# EAGLE schematic EncoderTBPCB (EAGLE 7.7.0)
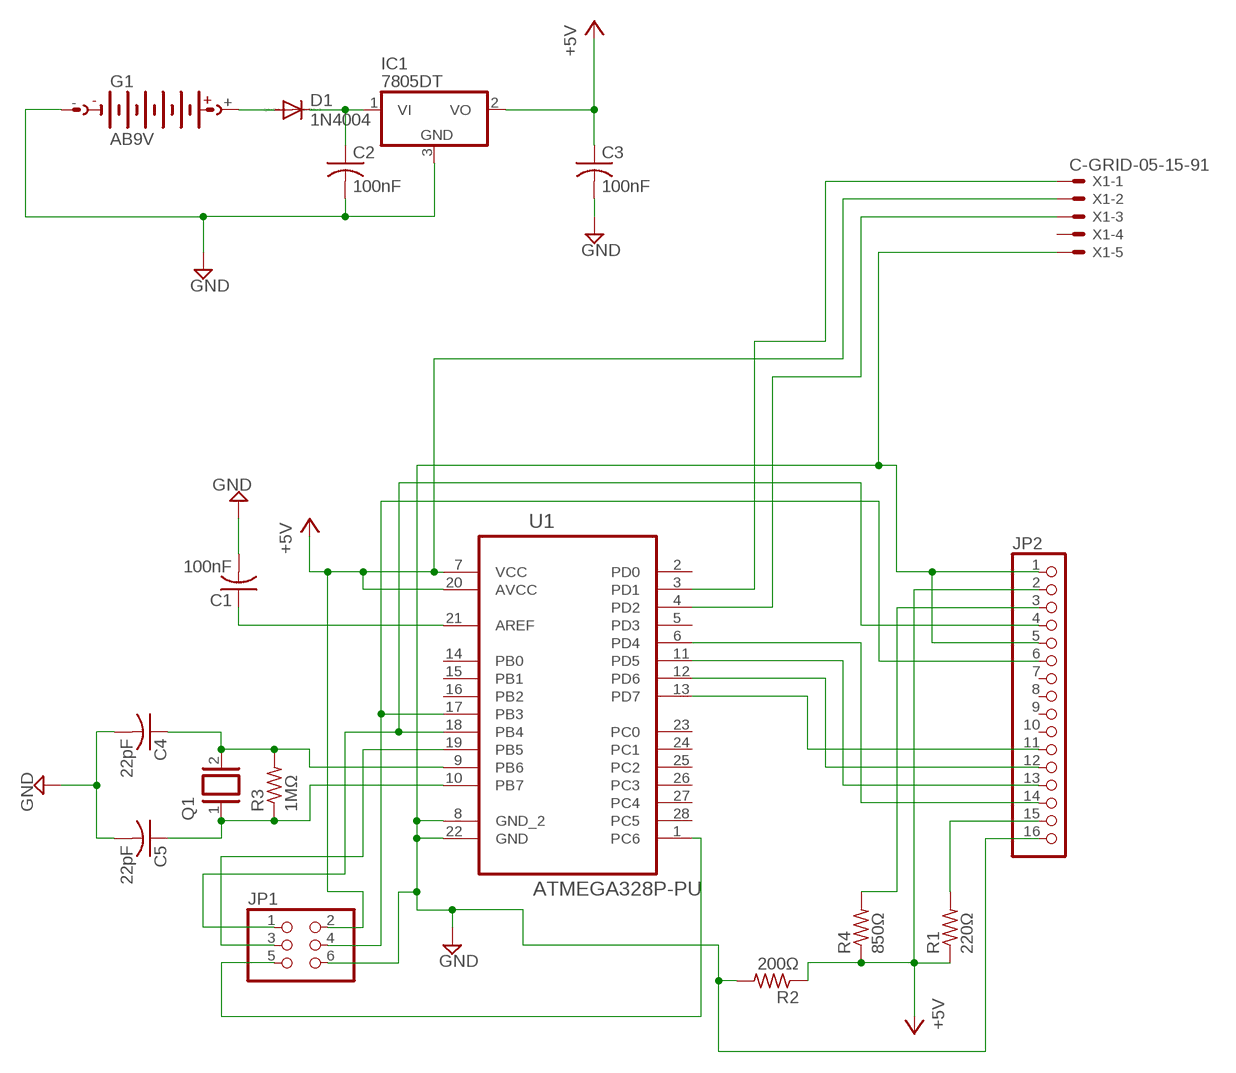
[diagram p0: schematic, sheet 1]

## Parts
C1  100nF  C-USC0603  [C0603]
C2  100nF  C-USC0603  [C0603]
C3  100nF  C-USC0603  [C0603]
C4  22pF  C-USC0603  [C0603]
C5  22pF  C-USC0603  [C0603]
D1  1N4004  [DO41-10]
G1  AB9V  [AB9V]
IC1  7805DT  [TO252]
JP1  PINHD-2X3  [2X03]
JP2  PINHD-1X16  [1X16]
Q1  XTAL/S  [QS]
R1  220Ω  R-US_R0603  [R0603]
R2  200Ω  R-US_R0603  [R0603]
R3  1MΩ  R-US_R0603  [R0603]
R4  850Ω  R-US_R0603  [R0603]
U1  ATMEGA328P-PU  [DIP254P762X457-28]
X1  C-GRID-05-15-91  [15-91-05]

## Nets
N$1: JP1.4 JP2.6 U1.17(PB3)
N$2: JP2.15 R1.2
N$4: JP2.14 U1.6(PD4)
N$5: JP2.13 U1.11(PD5)
N$6: JP2.12 U1.12(PD6)
N$7: JP2.11 U1.13(PD7)
N$9: JP1.1 JP2.4 U1.18(PB4)
N$10: C4.1 Q1.2 R3.2 U1.9(PB6)
N$11: C5.1 Q1.1 R3.1 U1.10(PB7)
N$12: C1.1 U1.21(AREF)
N$13: U1.3(PD1) X1.1
N$14: U1.4(PD2) X1.3
N$15: D1.A G1.+
N$16: C2.1 D1.C IC1.1(VI)
N$18: JP1.3 U1.19(PB5)
N$19: JP1.5 U1.1(PC6)
VDD: C3.1 IC1.2(VO) JP1.2 JP2.2 R1.1 R2.1 R4.1 U1.7(VCC) U1.20(AVCC) X1.2 ; supply symbol labelled +5V
VO: JP2.3 R4.2
VSS: C1.2 C2.2 C3.2 C4.2 C5.2 G1.- IC1.3(GND) JP1.6 JP2.1 JP2.5 JP2.16 R2.2 U1.8(GND_2) U1.22(GND) X1.5 ; supply symbol labelled GND
Unconnected: JP2.7 JP2.8 JP2.9 JP2.10 U1.2(PD0) U1.5(PD3) U1.14(PB0) U1.15(PB1) U1.16(PB2) U1.23(PC0) U1.24(PC1) U1.25(PC2) U1.26(PC3) U1.27(PC4) U1.28(PC5) X1.4

## Library data of the parts
C1-C5 = resistor:C-US: CAPACITOR, American symbol
D1 = diode:1N4004: DIODE general purpose rectifier, 1 A
G1 = battery:AB9V: 9-V BATTERY CLIP
IC1 = linear:78*: Positive VOLTAGE REGULATOR Source: http://cache.national.com/ds/LM/LM78L05.pdf http://www.fairchildsemi.com/ds/LM/LM7805.pdf
JP1 = pinhead:PINHD-2X3: PIN HEADER
JP2 = pinhead:PINHD-1X16: PIN HEADER
Q1 = special:XTAL/S: CRYSTAL
R1-R4 = resistor:R-US_: RESISTOR, American symbol
U1 = Atmel_By_element14_Batch_1-00:ATMEGA328P-PU: 8-bit Microcontroller with In-System Programmable Flash; MPN: ATMEGA328P-PU; OC_FARNELL: 1715487; OC_NEWARK: 15R0268; PACKAGE: PDIP-28; SUPPLIER: Atmel
X1 = con-molex:C-GRID-05: CONNECTOR wire to board 2.54 mm (0.100") pitch header